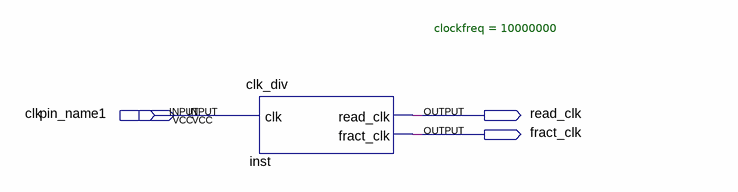
[diagram p0: schematic sheet]
// Quartus schematic clk_div_sim.bdf as structural Verilog: 1 symbols, 4 pins
module clk_div_sim (
  input  clk,
  input  pin_name1,
  output read_clk,
  output fract_clk
);

  clk_div #(.clockfreq(10000000)) inst (.clk(pin_name1), .read_clk(read_clk), .fract_clk(fract_clk));
endmodule
